# EAGLE schematic Main_board_revB (EAGLE 7.0.0)
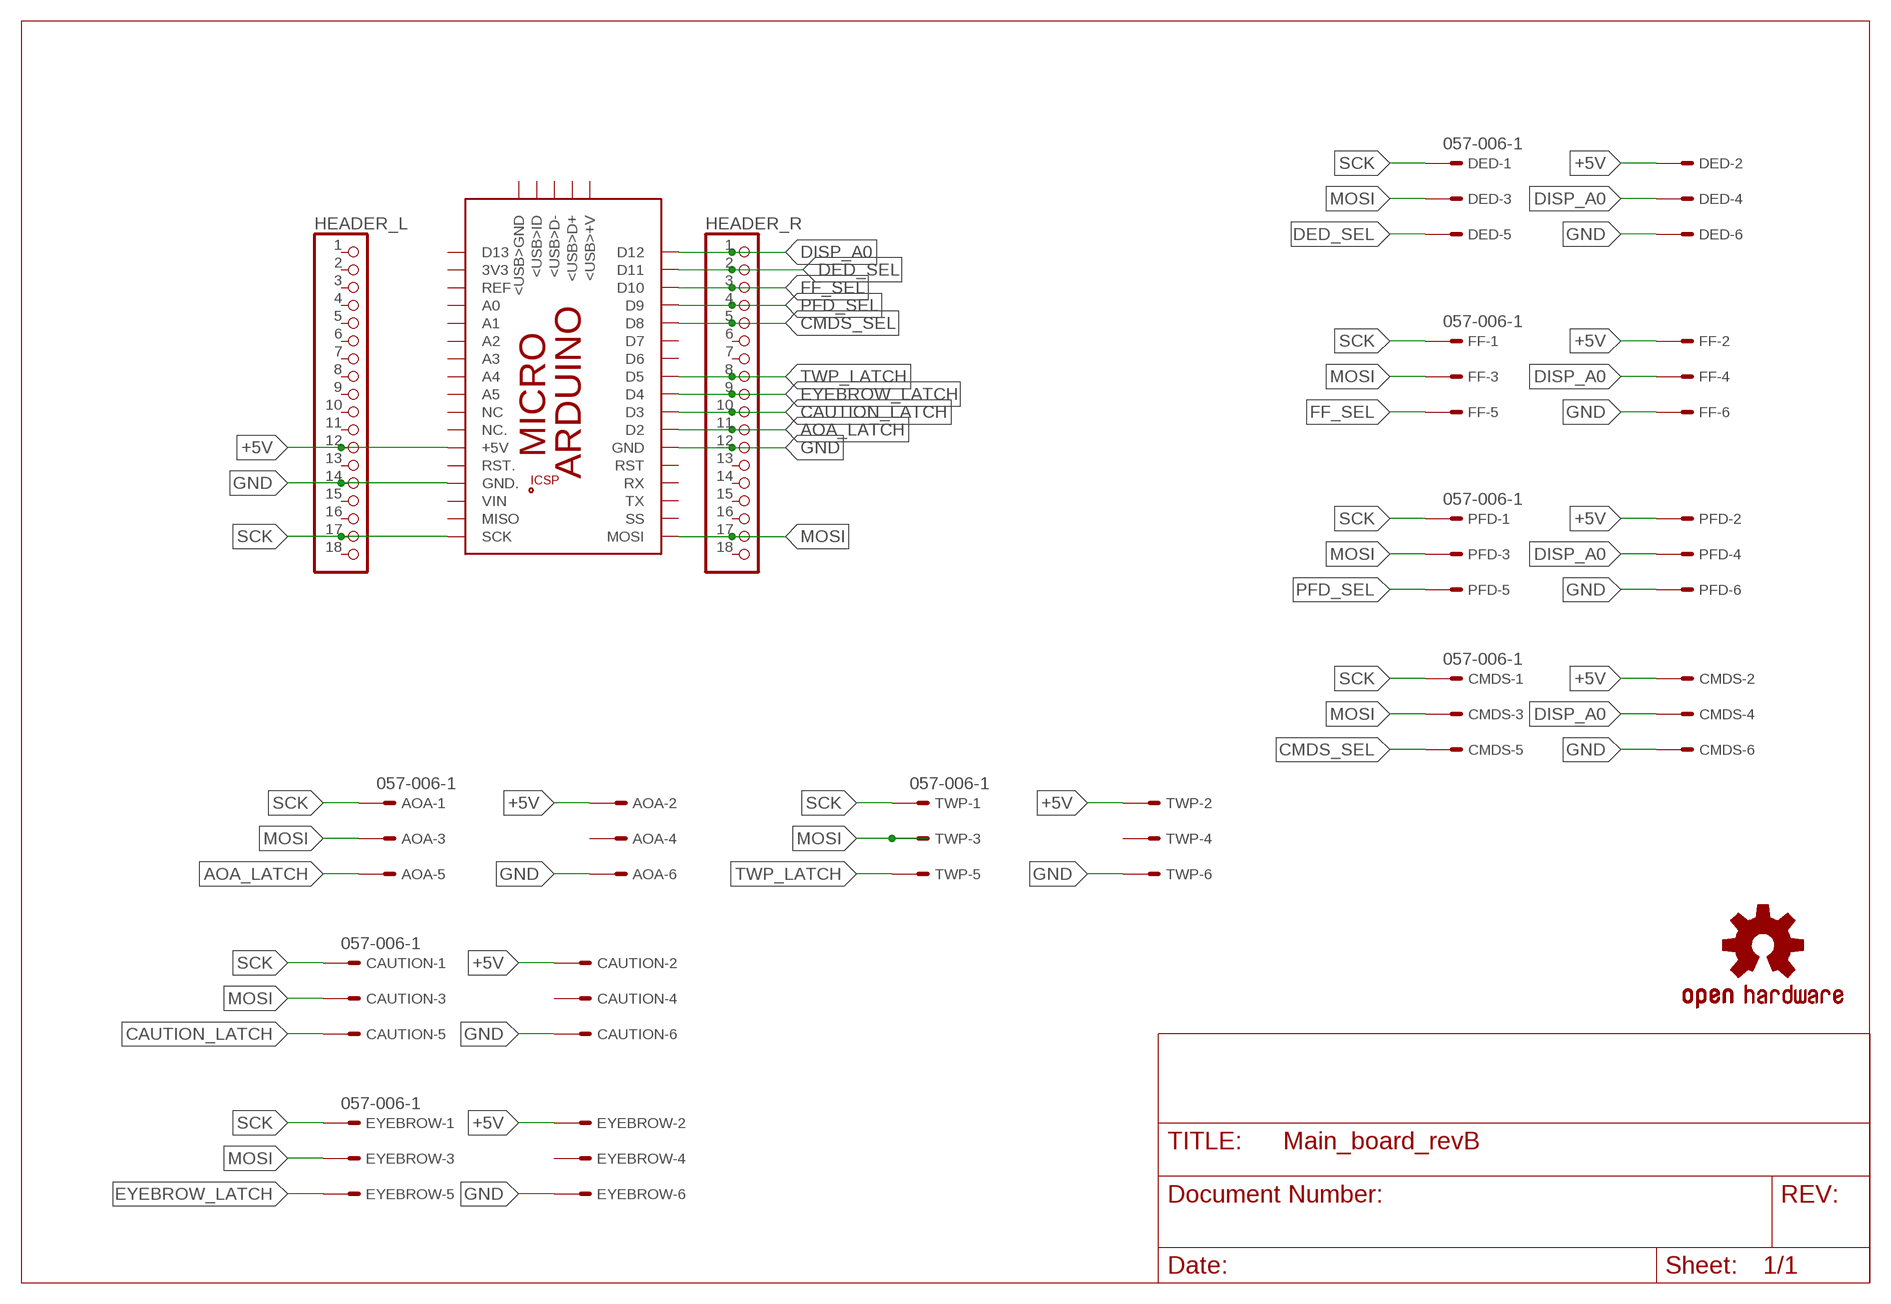
[diagram p0: schematic, sheet 1]

## Parts
AOA  057-006-1  [057-006-1]
CAUTION  057-006-1  [057-006-1]
CMDS  057-006-1  [057-006-1]
DED  057-006-1  [057-006-1]
EYEBROW  057-006-1  [057-006-1]
FF  057-006-1  [057-006-1]
HEADER_L  PINHD-1X18  [1X18]
HEADER_R  PINHD-1X18  [1X18]
LOGO1  OSHW-LOGOL  [OSHW-LOGO-L]
PCB1  ARDUINO_MICRO_EXT  (no package)
PFD  057-006-1  [057-006-1]
TWP  057-006-1  [057-006-1]

## Nets
+5V [Power]: AOA.2 CAUTION.2 CMDS.2 DED.2 EYEBROW.2 FF.2 HEADER_L.12 PCB1.+5V PFD.2 TWP.2
AOA_LATCH [Normal]: AOA.5 HEADER_R.11 PCB1.D2
CAUTION_LATCH [Normal]: CAUTION.5 HEADER_R.10 PCB1.D3
CMDS_SEL [Normal]: CMDS.5 HEADER_R.5 PCB1.D8
DED_SEL [Normal]: DED.5 HEADER_R.2 PCB1.D11
DISP_A0 [Normal]: CMDS.4 DED.4 FF.4 HEADER_R.1 PCB1.D12 PFD.4
EYEBROW_LATCH [Normal]: EYEBROW.5 HEADER_R.9 PCB1.D4
FF_SEL [Normal]: FF.5 HEADER_R.3 PCB1.D10
GND [Power]: AOA.6 CAUTION.6 CMDS.6 DED.6 EYEBROW.6 FF.6 HEADER_L.14 HEADER_R.12 PCB1.GND PCB1.GND. PFD.6 TWP.6
MOSI [Normal]: AOA.3 CAUTION.3 CMDS.3 DED.3 EYEBROW.3 FF.3 HEADER_R.17 PCB1.MOSI PFD.3 TWP.3
PFD_SEL [Normal]: HEADER_R.4 PCB1.D9 PFD.5
SCK [Normal]: AOA.1 CAUTION.1 CMDS.1 DED.1 EYEBROW.1 FF.1 HEADER_L.17 PCB1.SCK PFD.1 TWP.1
TWP_LATCH [Normal]: HEADER_R.8 PCB1.D5 TWP.5
Unconnected: AOA.4 CAUTION.4 EYEBROW.4 HEADER_L.1 HEADER_L.2 HEADER_L.3 HEADER_L.4 HEADER_L.5 HEADER_L.6 HEADER_L.7 HEADER_L.8 HEADER_L.9 HEADER_L.10 HEADER_L.11 HEADER_L.13 HEADER_L.15 HEADER_L.16 HEADER_L.18 HEADER_R.6 HEADER_R.7 HEADER_R.13 HEADER_R.14 HEADER_R.15 HEADER_R.16 HEADER_R.18 PCB1.3V3 PCB1.5V PCB1.<USB>+V PCB1.<USB>D+ PCB1.<USB>D- PCB1.<USB>GND PCB1.<USB>ID PCB1.A0 PCB1.A1 PCB1.A2 PCB1.A3 PCB1.A4 PCB1.A5 PCB1.D6 PCB1.D7 PCB1.D13 PCB1.GND_ PCB1.MISO PCB1.MISO. PCB1.MOSI. PCB1.NC PCB1.NC. PCB1.REF PCB1.RESET.. PCB1.RST PCB1.RST. PCB1.RX PCB1.SCK. PCB1.SS PCB1.TX PCB1.VIN TWP.4

## Library data of the parts
AOA CAUTION CMDS DED EYEBROW FF PFD TWP = con-panduit:057-006-: CONNECTOR 6-pin series 057 contact pc board low profile headers; OC_FARNELL: unknown; OC_NEWARK: unknown
HEADER_L HEADER_R = pinhead:PINHD-1X18: PIN HEADER
LOGO1 = SparkFun-Aesthetics:OSHW-LOGO: Open Source Hardware Logo This logo indicates the piece of hardware it is found on incorporates a OSHW license and/or adheres to the definition of open source hardware found here: http://freedomdefined.org/OSHW
PCB1 = E14_Arduino_published:ARDUINO_MICRO_EXT: Device for representing an Arduino Micro board in an EAGLE design without the PCB footprint. Created by Dave Young for Element14. More EAGLE documentation at: http://www.element14.com/community/community/knode/cadsoft_eagle

## Net classes
1 Power: width 0.762 mm, drill 0.508 mm, clearance 0.508 mm
2 Normal: width 0.254 mm, drill 0.203 mm, clearance 0.254 mm